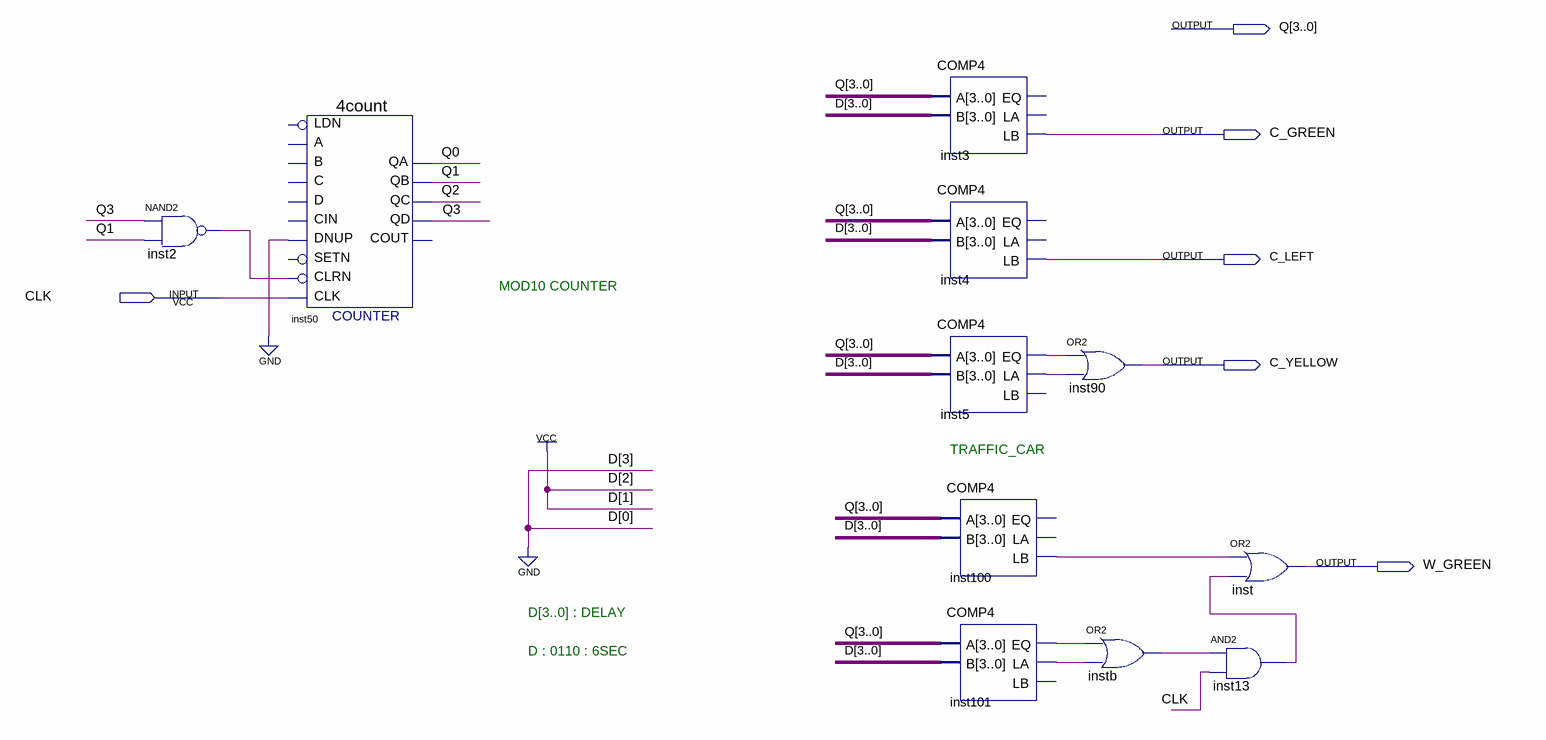
[diagram p0: schematic sheet]
// Quartus schematic TC.bdf as structural Verilog: 11 symbols, 6 pins
module TC (
  input  CLK,
  output [3:0] Q,
  output C_GREEN,
  output C_LEFT,
  output C_YELLOW,
  output W_GREEN
);

  wire inst2_out, inst5_eq, inst5_la, inst13_out, inst100_lb, inst101_eq, inst101_la, instb_out;

  nand inst2 (inst2_out, Q[3], Q[1]);
  \4count  inst50 (
    .DNUP(1'b0), .CLK(CLK), .CLRN(inst2_out), .QA(Q[0]), .QB(Q[1]), .QC(Q[2]), .QD(Q[3]));  // open: LDN, B, A, D, CIN, SETN, C, COUT
  COMP4 inst3 (.A(Q), .B(4'b0110), .LB(C_GREEN));  // open: EQ, LA
  COMP4 inst4 (.A(Q), .B(4'b0110), .LB(C_LEFT));  // open: EQ, LA
  COMP4 inst5 (.A(Q), .B(4'b0110), .EQ(inst5_eq), .LA(inst5_la));  // open: LB
  COMP4 inst100 (.A(Q), .B(4'b0110), .LB(inst100_lb));  // open: EQ, LA
  COMP4 inst101 (.A(Q), .B(4'b0110), .EQ(inst101_eq), .LA(inst101_la));  // open: LB
  or inst90 (C_YELLOW, inst5_eq, inst5_la);
  or instb (instb_out, inst101_eq, inst101_la);
  or inst (W_GREEN, inst100_lb, inst13_out);
  and inst13 (inst13_out, instb_out, CLK);

  // Notes on the sheet:
  //   MOD10 COUNTER
  //   TRAFFIC_CAR
  //   D[3..0] : DELAY
  //   D : 0110 : 6SEC
endmodule
